# EasyEDA Pro project ProDoc_fly_ctrl3_2_2024-11-25.epro

# Board fly_ctrl3_2
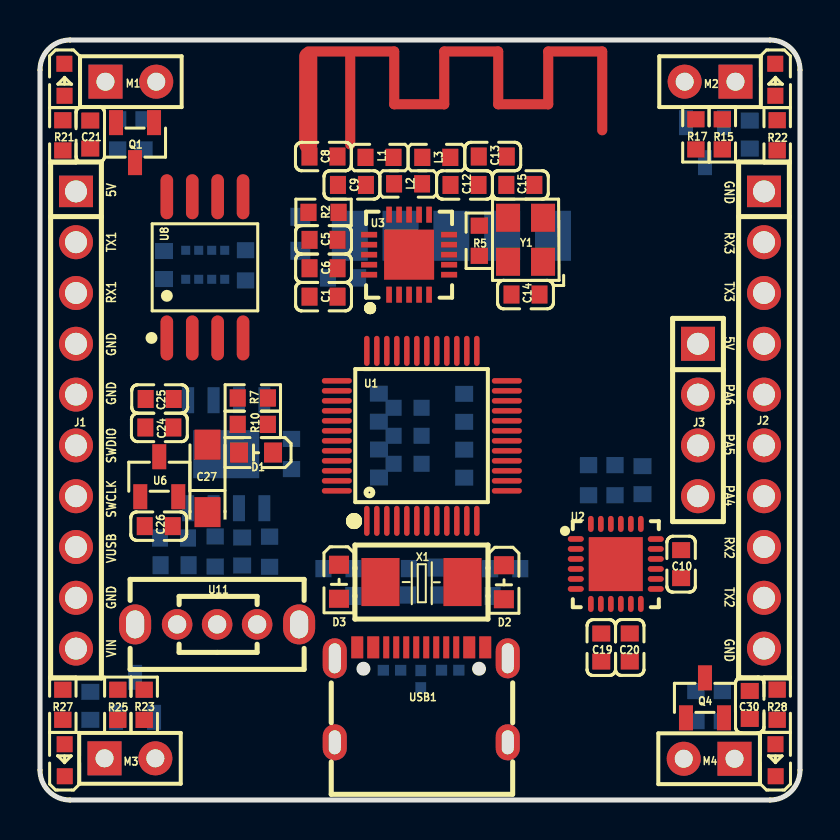
[diagram p0: board, top side]
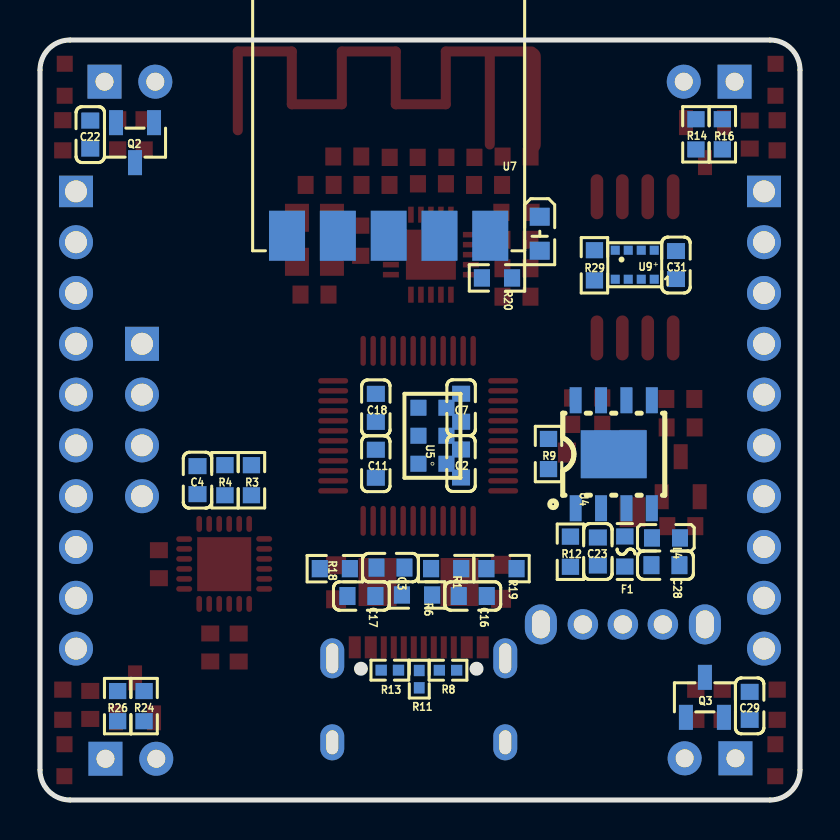
[diagram p1: board, bottom side, seen from below]

Outline 38 x 38 mm; copper layers: Top Layer, VCC, GND, Bottom Layer. Coordinates in mm from the lower left corner of the outline.
Outline path: 0,36.5 0,1.5 arc(0.44,0.44) 1.5,0 36.5,0 arc(37.56,0.44) 38,1.5 38,36.5 arc(37.56,37.56) 36.5,38 1.5,38 arc(0.44,37.56) 0,36.5
Stack: Top Layer 0.035mm 外层铜厚1oz / Dielectric1 0.2104mm 7628 RC49% 8.6mil / VCC 0.035mm / Dielectric4 0.48mm PP er 4.5 / GND 0.035mm / Dielectric5 0.48mm PP er 4.5 / Bottom Layer 0.035mm 外层铜厚1oz

## Design rules (mm)
template: JLCPCB Capability(Two Layers Board)
spacing copperThickness1oz (default): track to track 0.102, other pairs 0.152 to 0.3
spacing copperThickness2oz: track to track 0.203, other pairs 0.152 to 0.3
track width copperThickness1oz (default): min 0.127, default 0.254, max 2.54
track width copperThickness2oz: min 0.203, default 0.254, max 2.54
differential pair differentialPair (default): width min 0.127, default 0.254, max 2.54; gap min 0.152, default 0.152
via viaSize (default): diameter min 0.5, default 0.61, max 10; hole min 0.3, default 0.305, max 6.3

## Placement (name value [footprint] x y rotation side)
C1  33nF  [C0603]  14.18 25.17 0 top
C2  100nF  [C0603]  16.95 16.82 90 bottom
C3  100nF  [C0603]  20.48 11.62 0 bottom
C4  2.2nF  [C0603]  30.12 15.99 90 bottom
C5  4.7uF  [C0603]  14.18 28.01 0 top
C6  100nF  [C0603]  14.18 26.59 0 top
C7  100nF  [C0603]  16.94 19.62 270 bottom
C8  1pF  [C0603]  14.17 32.17 180 top
C9  1.5pF  [C0603]  15.6 30.75 0 top
C10  100nF  [C0603]  32.06 11.79 90 top
C11  100nF  [C0603]  21.21 16.81 90 bottom
C12  2.2nF  [C0603]  21.22 30.75 180 top
C13  4.7pF  [C0603]  22.64 32.17 180 top
C14  22pF  [C0603]  24.28 25.27 0 top
C15  22pF  [C0603]  24.02 30.75 0 top
C16  22pF  [C0603]  16.36 10.2 0 bottom
C17  22pF  [C0603]  21.93 10.2 0 bottom
C18  100nF  [C0603]  21.21 19.61 90 bottom
C19  10nF  [C0603]  28.06 7.62 90 top
C20  100nF  [C0603]  29.49 7.63 90 top
C21  4.7uF  [C0603]  2.51 33.27 270 top
C22  4.7uF  [C0603]  35.49 33.27 270 bottom
C23  10uF  [C0603]  10.11 12.42 90 bottom
C24  20uF  [C0603]  5.97 18.63 180 top
C25  1uF  [C0603]  5.98 20.05 0 top
C26  1uF  [C0603]  5.94 13.69 0 top
C27  47uF  [CAP-SMD_L3.2-W1.6-RD]  8.37 16.08 90 top
C28  22uF  [C0603]  6.73 11.74 0 bottom
C29  4.7uF  [C0603]  2.52 4.71 90 bottom
C30  4.7uF  [C0603]  35.49 4.75 90 top
C31  100nF  [C0603]  6.2 26.75 270 bottom
D1  NCD0603G1  [LED0603-RD_1]  10.8 17.37 180 top
D2  NCD0603G1  [LED0603-RD_1]  23.19 10.89 270 top
D3  NCD0603G1  [LED0603-RD_1]  14.95 10.91 270 top
D4  NCD0603G1  [LED0603-RD_1]  13.02 28.31 270 bottom
D5  NCD0603R1  [LED0603-RD_RED]  1.22 36.01 270 top
D6  NCD0603R1  [LED0603-RD_RED]  36.77 36.01 270 top
D7  NCD0603R1  [LED0603-RD_RED]  1.24 1.99 90 top
D8  NCD0603R1  [LED0603-RD_RED]  36.78 1.99 90 top
F1  BSMD0603-050-6V  [F0603]  8.76 12.42 90 bottom
J1  PZ254V-11-10P  [HDR-TH_10P-P2.54-V-M]  1.8 19 270 top
J2  PZ254V-11-10P  [HDR-TH_10P-P2.54-V-M]  36.2 19 270 top
J3  PZ254V-11-04P  [HDR-TH_4P-P2.54-V-M]  32.9 19 270 top
L1  3.9nH  [L0603]  16.98 32.13 180 top
L2  8.2nH  [L0603]  18.4 30.81 180 top
L3  2.7nH  [L0603]  19.81 32.13 180 top
L4  2.2uH  [L0603]  6.7 13.1 180 bottom
M1  720  [HDR2.54-LI-2P]  4.54 35.92 0 top
M2  720  [HDR2.54-LI-2P]  33.5 35.92 180 top
M3  720  [HDR2.54-LI-2P]  4.5 2.08 0 top
M4  720  [HDR2.54-LI-2P]  33.46 2.06 180 top
Q1  SI2302  [SOT-23-3_L2.9-W1.3-P1.90-LS2.4-BR]  4.75 32.87 90 top
Q2  SI2302  [SOT-23-3_L2.9-W1.3-P1.90-LS2.4-BR]  33.25 32.87 90 bottom
Q3  SI2302  [SOT-23-3_L2.9-W1.3-P1.90-LS2.4-BR]  4.75 5.13 270 bottom
Q4  SI2302  [SOT-23-3_L2.9-W1.3-P1.90-LS2.4-BR]  33.25 5.11 270 top
R1  10kΩ  [R0603]  17.69 11.57 180 bottom
R2  22kΩ  [R0603]  14.18 29.38 180 top
R3  10kΩ  [R0603]  27.43 15.99 90 bottom
R4  10kΩ  [R0603]  28.75 15.99 90 bottom
R5  1MΩ  [R0603]  21.97 27.96 90 top
R6  1MΩ  [R0603]  19.15 10.25 180 bottom
R7  10kΩ  [R0603]  10.64 20.1 0 top
R8  5.1kΩ  [R0402]  17.6 6.49 180 bottom
R9  100kΩ  [R0603]  12.57 17.3 90 bottom
R10  3kΩ  [R0603]  10.64 18.78 180 top
R11  1.5kΩ  [R0402]  19.04 6.04 90 bottom
R12  1kΩ  [R0603]  11.48 12.41 90 bottom
R13  5.1kΩ  [R0402]  20.51 6.49 0 bottom
R14  100Ω  [R0603]  5.2 33.28 270 bottom
R15  100Ω  [R0603]  32.79 33.28 270 top
R16  10kΩ  [R0603]  3.88 33.28 90 bottom
R17  10kΩ  [R0603]  34.12 33.28 90 top
R18  1kΩ  [R0603]  23.26 11.57 0 bottom
R19  1kΩ  [R0603]  14.93 11.57 180 bottom
R20  1kΩ  [R0603]  15.15 26.1 180 bottom
R21  1kΩ  [R0603]  1.14 33.23 270 top
R22  1kΩ  [R0603]  36.86 33.24 270 top
R23  100Ω  [R0603]  5.21 4.76 90 top
R24  100Ω  [R0603]  32.8 4.69 90 bottom
R25  10kΩ  [R0603]  3.89 4.76 270 top
R26  10kΩ  [R0603]  34.12 4.69 270 bottom
R27  1kΩ  [R0603]  1.14 4.76 90 top
R28  1kΩ  [R0603]  36.86 4.76 90 top
R29  10kΩ  [R0603]  10.28 26.74 90 bottom
U1  STM32F103C8T6  [LQFP-48_L7.0-W7.0-P0.50-LS9.0-BL]  19.09 18.21 0 top
U2  MPU-6050  [QFN-24_L4.0-W4.0-P0.50-BL-EP2.7]  28.84 11.75 0 top
U3  Si24R1  [QFN-20_L4.0-W4.0-P0.50-BL-EP]  18.45 27.27 0 top
U4  LGS5500EP  [ESOP-8_L4.9-W3.9-P1.27-LS6.0-TL-EP3.3]  9.31 17.29 90 bottom
U5  -  [BOOT]  19.08 18.21 180 bottom
U6  662K  [SOT-23-3_L2.9-W1.3-P1.90-LS2.4-BR]  5.96 16.16 270 top
U7  VG6328A  [COMM-SMD_VG6328A]  20.56 28.2 180 bottom
U8  W25Q32JVSSIQ  [SOIC-8_L5.3-W5.3-P1.27-LS8.0-BL]  8.25 26.63 0 top
U9  SPL06-001  [SENSOR-SMD_SPL06-001]  8.26 26.76 180 bottom
U11  SS-12D02-VG3  [SW-TH_DEALON_SS-12D02-VGX]  8.86 8.78 0 top
USB1  TYPE-C 16PIN 2MD(073)  [USB-C-SMD_TYPE-C-6PIN-2MD-073]  19.06 5.26 0 top
X1  8MHz  [CRYSTAL-SMD_L5.0-W3.2]  19.07 10.9 0 top
Y1  16MHz  [OSC-SMD_4P-L3.2-W2.5-BL]  24.28 28.01 90 top

## Footprints (pads in the part's own frame, mm; a bottom-side part is the same pattern mirrored in y, then rotated)
BOOT
  rect 0.8x0.8 smd: 1(1.398,1.4) 2(1.398,0) 3(1.398,-1.4) 4(-0.002,1.4) 5(-0.002,0) 6(-0.002,-1.4)
C0603
  rect 0.8x0.9 smd: 1(-0.7,-0.002) 2(0.7,-0.002)
CAP-SMD_L3.2-W1.6-RD
  rect 1.5x1.296 smd: 1(-1.687,0) 2(1.687,0)
COMM-SMD_VG6328A
  rect 1.8x2.5 smd: 1(-5.09,0.01) 2(-2.55,0.01) 3(-0.01,0.01) 4(2.53,0.01) 5(5.07,0.01)
CRYSTAL-SMD_L5.0-W3.2
  rect 1.9x2.4 smd: 1(-2.05,0) 2(2.05,0)
ESOP-8_L4.9-W3.9-P1.27-LS6.0-TL-EP3.3
  rect 1.3x0.6 smd: 1(-2.7,1.905) 2(-2.7,0.635) 3(-2.7,-0.635) 4(-2.7,-1.905) 5(2.7,-1.905) 6(2.7,-0.635) 7(2.7,0.635) 8(2.7,1.905)
  rect 2.4x3.3 smd: 9(0,0)
F0603
  rect 0.806x0.864 smd: 1(-0.753,0) 2(0.753,0)
HDR2.54-LI-2P
  rect 1.7x1.7 hole 0.9: 1(-1.27,0)
  round 1.7 hole 0.9: 2(1.27,0)
HDR-TH_4P-P2.54-V-M
  rect 1.7x1.7 hole 1.1: 1(-3.81,0)
  round 1.7 hole 1.1: 2(-1.27,0) 3(1.27,0) 4(3.81,0)
HDR-TH_10P-P2.54-V-M
  rect 1.575x1.7 hole 1.1: 1(-11.43,0)
  round 1.7 hole 1.1: 2(-8.89,0) 3(-6.35,0) 4(-3.81,0) 5(-1.27,0) 6(1.27,0) 7(3.81,0) 8(6.35,0) 9(8.89,0) 10(11.43,0)
L0603
  rect 0.8x0.864 smd: 1(-0.7,0) 2(0.7,0)
LED0603-RD_1
  rect 0.9x1 smd: 1(-0.85,0) 2(0.85,0)
LED0603-RD_RED
  rect 0.8x0.8 smd: 1(-0.799,-0.004) 2(0.799,0.004)
LQFP-48_L7.0-W7.0-P0.50-LS9.0-BL
  oval 0.27x1.5 smd: 1(-2.75,-4.25) 2(-2.25,-4.25) 3(-1.75,-4.25) 4(-1.25,-4.25) 5(-0.75,-4.25) 6(-0.25,-4.25) 7(0.25,-4.25) 8(0.75,-4.25) 9(1.25,-4.25) 10(1.75,-4.25) 11(2.25,-4.25) 12(2.75,-4.25) 25(2.75,4.25) 26(2.25,4.25) 27(1.75,4.25) 28(1.25,4.25) 29(0.75,4.25) 30(0.25,4.25) 31(-0.25,4.25) 32(-0.75,4.25) 33(-1.25,4.25) 34(-1.75,4.25) 35(-2.25,4.25) 36(-2.75,4.25)
  oval 1.5x0.27 smd: 13(4.25,-2.75) 14(4.25,-2.25) 15(4.25,-1.75) 16(4.25,-1.25) 17(4.25,-0.75) 18(4.25,-0.25) 19(4.25,0.25) 20(4.25,0.75) 21(4.25,1.25) 22(4.25,1.75) 23(4.25,2.25) 24(4.25,2.75) 37(-4.25,2.75) 38(-4.25,2.25) 39(-4.25,1.75) 40(-4.25,1.25) 41(-4.25,0.75) 42(-4.25,0.25) 43(-4.25,-0.25) 44(-4.25,-0.75) 45(-4.25,-1.25) 46(-4.25,-1.75) 47(-4.25,-2.25) 48(-4.25,-2.75)
OSC-SMD_4P-L3.2-W2.5-BL
  rect 1.4x1.2 smd: 1(-1.1,-0.875) 2(1.1,-0.875) 3(1.1,0.875) 4(-1.1,0.875)
QFN-20_L4.0-W4.0-P0.50-BL-EP
  rect 0.28x0.8 smd: 1(-1,-2) 2(-0.5,-2) 3(0,-2) 4(0.5,-2) 5(1,-2) 11(1,2) 12(0.5,2) 13(0,2) 14(-0.5,2) 15(-1,2)
  rect 0.8x0.28 smd: 6(2,-1) 7(2,-0.5) 8(2,0) 9(2,0.5) 10(2,1) 16(-2,1) 17(-2,0.5) 18(-2,0) 19(-2,-0.5) 20(-2,-1)
  rect 2.5x2.5 smd: 21(0,0)
QFN-24_L4.0-W4.0-P0.50-BL-EP2.7
  rect 2.7x2.7 smd: (-0.044,0.044)
  oval 0.8x0.28 smd: 1(-2.045,1.307) 2(-2.045,0.807) 3(-2.045,0.307) 4(-2.045,-0.193) 5(-2.045,-0.693) 6(-2.045,-1.193) 13(1.956,-1.193) 14(1.956,-0.693) 15(1.956,-0.193) 16(1.956,0.307) 17(1.956,0.807) 18(1.956,1.299)
  oval 0.28x0.8 smd: 7(-1.294,-1.943) 8(-0.794,-1.943) 9(-0.294,-1.943) 10(0.205,-1.943) 11(0.706,-1.943) 12(1.206,-1.943) 19(1.206,2.057) 20(0.706,2.057) 21(0.205,2.057) 22(-0.294,2.057) 23(-0.794,2.057) 24(-1.294,2.057)
R0402
  rect 0.566x0.54 smd: 1(-0.433,0) 2(0.433,0)
R0603
  rect 0.806x0.864 smd: 1(-0.753,0) 2(0.753,0)
SENSOR-SMD_SPL06-001
  rect 0.45x0.45 smd: 1(0.975,-0.725) 2(0.325,-0.725) 3(-0.325,-0.725) 4(-0.975,-0.725) 5(-0.975,0.725) 6(-0.325,0.725) 7(0.325,0.725) 8(0.975,0.725)
SOIC-8_L5.3-W5.3-P1.27-LS8.0-BL
  oval 0.63x2.25 smd: 1(-1.905,-3.53) 2(-0.635,-3.53) 3(0.635,-3.53) 4(1.905,-3.53) 5(1.905,3.53) 6(0.635,3.53) 7(-0.635,3.53) 8(-1.905,3.53)
SOT-23-3_L2.9-W1.3-P1.90-LS2.4-BR
  rect 1.25x0.7 smd: 1(1,-0.95) 2(1,0.95) 3(-1,0)
SW-TH_DEALON_SS-12D02-VGX
  round 1.524 hole 0.914: 1(-2,0) 2(0,0) 3(2,0)
  oval 1.6x2 hole 0.9x1.4: 4(4.1,0) 5(-4.1,0)
USB-C-SMD_TYPE-C-6PIN-2MD-073
  rect 0.6x1.1 smd: 1(-3.2,2.375) 2(-2.4,2.375) 11(2.4,2.375) 12(3.2,2.375)
  rect 0.3x1.1 smd: 3(-1.75,2.375) 4(-1.25,2.375) 5(-0.75,2.375) 6(-0.25,2.375) 7(0.25,2.375) 8(0.75,2.375) 9(1.25,2.375) 10(1.75,2.375)
  oval 1.2x2 hole 0.6x1.5: 13(-4.325,1.825) 14(4.325,1.825)
  oval 1.2x1.8 hole 0.6x1.2: 13(-4.325,-2.375) 14(4.325,-2.375)

## Nets
3.3V: C2.1 C5.2 C6.2 C7.1 C10.1 C11.2 C18.2 C19.2 C26.2 C27.1 C31.1 D2.1 D3.1 D4.1 R1.2 R3.2 R4.2 R11.1 U1.9 U1.24 U1.36 U1.48 U2.8 U2.13 U3.7 U3.15 U3.18 U5.1 U5.4 U6.2 U7.4 U8.3 U8.7 U8.8 U9.6 U9.8
5V: C24.1 C25.2 J1.1 J2.4 J3.1 U4.5 U6.3
GND: C1.1 C2.2 C3.2 C4.2 C5.1 C6.1 C7.2 C8.2 C10.2 C11.1 C12.2 C13.1 C14.1 C15.2 C16.2 C17.1 C18.1 C19.1 C20.1 C23.1 C24.2 C25.1 C26.1 C27.2 C28.1 C31.2 D1.2 J1.4 J1.5 J1.9 J2.1 J2.10 J3.2 Q1.3 Q2.3 Q3.3 Q4.3 R2.2 R7.2 R8.2 R9.2 R12.1 R13.2 R16.1 R17.1 R18.1 R25.1 R26.1 R29.1 U1.8 U1.23 U1.35 U1.47 U2.1 U2.9 U2.11 U2.18 U3.8 U3.14 U3.17 U3.20 U3.21 U4.8 U4.9 U5.3 U5.6 U6.1 U7.3 U8.4 U9.1 U9.7 USB1.1 USB1.12 USB1.13 USB1.14 Y1.2 Y1.4
VBAT: C21.1 C22.1 C28.2 C29.1 C30.1 D5.1 D6.1 D7.1 D8.1 F1.2 L4.1 M1.1 M2.1 M3.1 M4.1 U4.3
VIN: J1.10 U11.1 U11.5
BOOT0: U1.44 U5.5
BOOT1: U1.20 U5.2
CE: U1.40 U3.1
CS1: U1.41 U3.2
CS2: U1.25 U8.1
LED1: R21.2 U1.38
LED2: R22.2 U1.17
LED3: R27.2 U1.10
LED4: R28.2 U1.11
MISO: U1.27 U3.5 U8.2
MOSI: U1.28 U3.4 U8.5
MPU_INT: U1.39 U2.12
NRF_IRQ: U1.29 U3.6
OSC_IN: C16.1 R6.1 U1.5 X1.1
OSC_OUT: C17.2 R6.2 U1.6 X1.2
PA4: J2.7 U1.14
PA5: J2.6 U1.15
PA6: J2.5 U1.16
PC13: R19.1 U1.2
PWM1: R14.2 U1.45
PWM2: R15.2 U1.19
PWM3: R23.2 U1.46
PWM4: R24.2 U1.18
RST: C3.1 R1.1 U1.7
RXD1: J1.3 U1.31
RXD2: J2.8 U1.13 U7.2
RXD3: J2.2 U1.22
SCK: U1.26 U3.3 U8.6
SCL: J3.3 R4.1 U1.42 U2.23 U9.4
SDA: J3.4 R3.1 U1.43 U2.24 U9.3
SWCLK: J1.7 U1.37
SWDIO: J1.6 U1.34
TXD1: J1.2 U1.30
TXD2: J2.9 U1.12 U7.1
TXD3: J2.3 U1.21
USBDM: U1.32 USB1.5 USB1.7
USBDP: R11.2 U1.33 USB1.6 USB1.8
VUSB: C23.2 J1.8 R12.2 U4.2 USB1.2 USB1.11
$1N42: C20.2 U2.10
$1N59: D6.2 R22.1
$1N81: R2.1 U3.16
$1N82: C1.2 U3.19
$1N83: C8.1 C9.1
$1N85: C14.2 R5.1 U3.9 Y1.1
$1N86: C15.1 R5.2 U3.10 Y1.3
$1N88: C29.2 M3.2 Q3.2
$1N90: C22.2 M2.2 Q2.2
$1N91: C21.2 M1.2 Q1.2
$1N122: L1.1 L2.2 U3.13
$1N123: L2.1 L3.2 U3.12
$1N124: C12.1 C13.2 L3.1 U3.11
$1N1531: Q1.1 R14.1 R16.2
$1N1536: C4.1 U2.20
$1N1557: C9.2 L1.2
$1N1588: Q2.1 R15.1 R17.2
$1N1589: Q3.1 R23.1 R25.2
$1N1590: Q4.1 R24.1 R26.2
$1N24218: D2.2 R18.2
$1N25042: R29.2 U9.5
$1N25237: R20.1 U7.5
$1N92283: C30.2 M4.2 Q4.2
$1N93213: L4.2 U4.4
$1N93916: R9.1 U4.1
$1N94129: R7.1 R10.2 U4.7
$1N94139: D1.1 R10.1
$1N102959: D3.2 R19.2
$1N103033: D4.2 R20.2
$1N103551: D8.2 R28.1
$1N103755: D5.2 R21.1
$1N103859: D7.2 R27.1
$1N175673: F1.1 U11.2 U11.3 U11.4
$1N176106: R8.1 USB1.4
$1N176118: R13.1 USB1.10

Pads without a net: U1 1 3 4; U2 2 3 4 5 6 7 14 15 16 17 19 21 22; U4 6; U9 2; USB1 3 9

## Copper pours and planes (outline as drawn; the poured copper is in the pictures)
GND on GND: 0.26,37.74 37.74,37.74 37.74,0.26 0.26,0.26

Small or netless copper shapes (teardrops, artwork), in the pictures only: 36 on GND

## Text on the board
Top Silkscreen Layer: 5V | TX1 | RX1 | GND | SWDIO | SWCLK | VUSB | VIN | RX3 | TX3 | PA6 | PA5 | PA4 | RX2 | TX2
